# Altium project Nevron_v4.PrjPCB
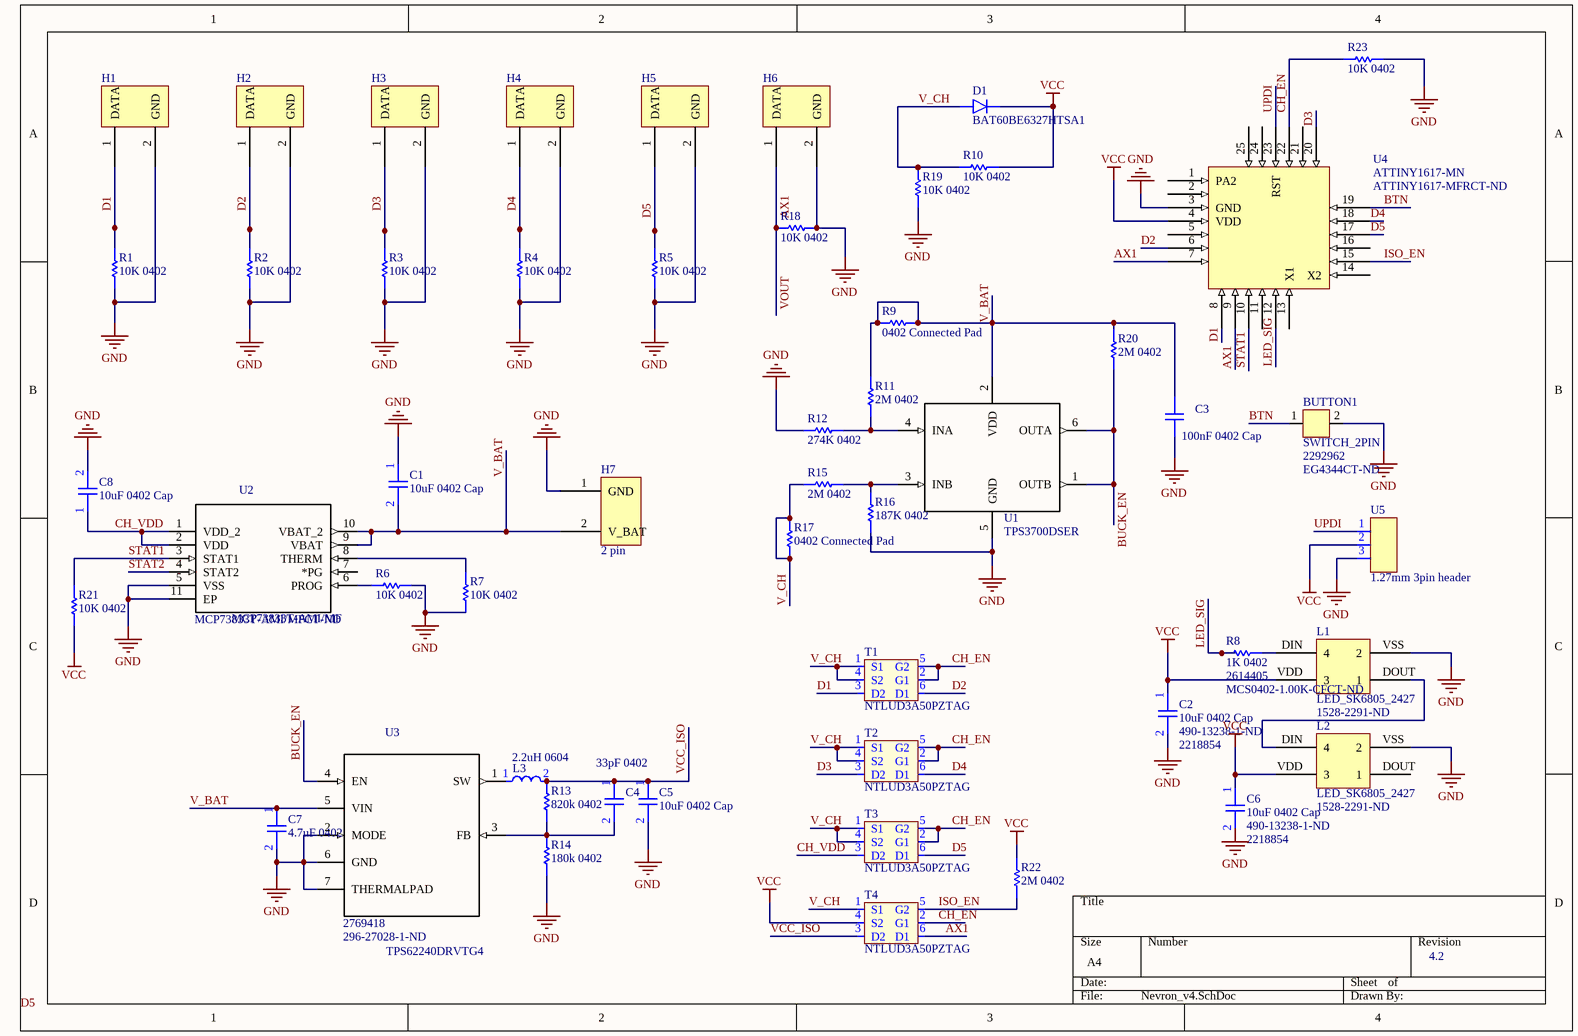
[diagram p0: Nevron_v4.SchDoc]
1 sheet, 52 parts. Net scope: global (net labels, ports and power ports of the same name join across sheets).
Board file: PCB4.PcbDoc

## Sheet Nevron_v4.SchDoc
size A4

### Parts
BUTTON1  SWITCH_2PIN  Supplier Part Number 1: 2292962  Supplier Part Number 2: EG4344CT-ND  [SWITCH- TL1015AF160QG]
C1  10uF 0402 Cap  [0402 Cap]
C2  10uF 0402 Cap  Supplier Part Number 1: 490-13238-1-ND  Supplier Part Number 2: 2218854  [0402 Cap]
C3  100nF 0402 Cap  [0402 Cap]
C4  33pF 0402  [0402 Cap]
C5  10uF 0402 Cap  [0402 Cap]
C6  10uF 0402 Cap  Supplier Part Number 1: 490-13238-1-ND  Supplier Part Number 2: 2218854  [0402 Cap]
C7  4.7uF 0402  [0402 Cap]
C8  10uF 0402 Cap  [0402 Cap]
D1  BAT60BE6327HTSA1  [BAT60BE6327HTSA1]
H1  Magnetci con. 2 pin  [Magnetic con. 2 pin]  (value not drawn)
H2  Magnetci con. 2 pin  [Magnetic con. 2 pin]  (value not drawn)
H3  Magnetci con. 2 pin  [Magnetic con. 2 pin]  (value not drawn)
H4  Magnetci con. 2 pin  [Magnetic con. 2 pin]  (value not drawn)
H5  Magnetci con. 2 pin  [Magnetic con. 2 pin]  (value not drawn)
H6  Magnetci con. 2 pin  [Magnetic con. 2 pin]  (value not drawn)
H7  2 pin  [2_PIN]
L1  LED_SK6805_2427  Supplier Part Number 1: 1528-2291-ND  [LED_SK6805_2427]
L2  LED_SK6805_2427  Supplier Part Number 1: 1528-2291-ND  [LED_SK6805_2427]
L3  2.2uH 0604  [0603 inductor]
R1  10K 0402  [0402 Res]
R2  10K 0402  [0402 Res]
R3  10K 0402  [0402 Res]
R4  10K 0402  [0402 Res]
R5  10K 0402  [0402 Res]
R6  10K 0402  [0402 Res]
R7  10K 0402  [0402 Res]
R8  1K 0402  Supplier Part Number 1: 2614405  Supplier Part Number 2: MCS0402-1.00K-CFCT-ND  [0402 Res]
R9  0402 Connected Pad  [0402 connected pad]
R10  10K 0402  [0402 Res]
R11  2M 0402  [0402 Res]
R12  274K 0402  [0402 Res]
R13  820k 0402  [0402 Res]
R14  180k 0402  [0402 Res]
R15  2M 0402  [0402 Res]
R16  187K 0402  [0402 Res]
R17  0402 Connected Pad  [0402 connected pad]
R18  10K 0402  [0402 Res]
R19  10K 0402  [0402 Res]
R20  2M 0402  [0402 Res]
R21  10K 0402  [0402 Res]
R22  2M 0402  [0402 Res]
R23  10K 0402  [0402 Res]
T1  NTLUD3A50PZTAG  [NTLUD3A50PZTAG]
T2  NTLUD3A50PZTAG  [NTLUD3A50PZTAG]
T3  NTLUD3A50PZTAG  [NTLUD3A50PZTAG]
T4  NTLUD3A50PZTAG  [NTLUD3A50PZTAG]
U1  TPS3700DSER  [TPS3700DSER]
U2  MCP73833T-AMI/MF  Supplier Part Number 1: MCP73833T-AMI/MFCT-ND  [MCP73833T-AMI/MF]
U3  TPS62240DRVTG4  Supplier Part Number 1: 2769418  Supplier Part Number 2: 296-27028-1-ND  [TPS62240DRVR]
U4  ATTINY1617-MN  Supplier Part Number 1: ATTINY1617-MFRCT-ND  [ATtiny1617_QFN50P400X400X90_HS-25M]
U5  1.27mm 3pin header  [1.27mm 3pin header]

### Nets
GND: BUTTON1.2 C1.1 C2.2 C3.2 C5.2 C6.2 C7.2 C8.2 H1.2(GND) H2.2(GND) H3.2(GND) H4.2(GND) H5.2(GND) H6.2(GND) H7.1(GND) L1.VSS(2) L2.VSS(2) R1.2 R2.2 R3.2 R4.2 R5.2 R6.2 R7.2 R12.1 R14.2 R16.2 R18.2 R19.2 R23.2 U1.5(GND) U2.5(VSS) U2.11(EP) U3.2(MODE) U3.6(GND) U3.7(THERMALPAD) U4.3(GND) U5.3
VCC: C2.1 C6.1 D1.K L1.VDD(3) L2.VDD(3) R10.2 R21.2 R22.1 T4.4(S2) U4.4(VDD) U5.2
AX1: H6.1(DATA) R18.1 T4.6(D1) U4.7 U4.9  [also labelled VOUT]
BTN: BUTTON1.1 U4.19
BUCK_EN: R20.2 U1.1(OUTB) U1.6(OUTA) U3.4(EN)
CH_EN: R23.1 T1.2(G1) T1.5(G2) T2.2(G1) T2.5(G2) T3.2(G1) T3.5(G2) T4.2(G1) U4.22
CH_VDD: C8.1 T3.3(D2) U2.1(VDD_2) U2.2(VDD)
D1: H1.1(DATA) R1.1 T1.3(D2) U4.8
D2: H2.1(DATA) R2.1 T1.6(D1) U4.6
D3: H3.1(DATA) R3.1 T2.3(D2) U4.20
D4: H4.1(DATA) R4.1 T2.6(D1) U4.18
D5: H5.1(DATA) R5.1 T3.6(D1) U4.17
ISO_EN: R22.2 T4.5(G2) U4.15
LED_SIG: R8.1 U4.12
STAT1: R21.1 U2.3(STAT1) U4.10
STAT2: U2.4(STAT2)
UPDI: U4.23(RST) U5.1
V_BAT: C1.2 C3.1 C7.1 H7.2(V_BAT) R9.1 R9.2 R11.1 R20.1 U1.2(VDD) U2.9(VBAT) U2.10(VBAT_2) U3.5(VIN)
V_CH: D1.A R10.1 R15.1 R17.1 R17.2 R19.1 T1.1(S1) T1.4(S2) T2.1(S1) T2.4(S2) T3.1(S1) T3.4(S2) T4.1(S1)
VCC_ISO: C4.1 C5.1 L3.2 R13.1 T4.3(D2)
NetC4_2: C4.2 R13.2 R14.1 U3.3(FB)
NetL1_DIN: L1.DIN(4) R8.2
NetL1_DOUT: L1.DOUT(1) L2.DIN(4)
NetL3_1: L3.1 U3.1(SW)
NetR6_1: R6.1 U2.6(PROG)
NetR7_1: R7.1 U2.8(THERM)
NetR11_2: R11.2 R12.2 U1.4(INA)
NetR15_2: R15.2 R16.1 U1.3(INB)

Not connected (* = marked no-connect by the designer): L2 DOUT(1); U2 7(*PG); U4 1(PA2) 2 5 11 13(X1) 14(X2) 16 21 24 25

### Notes on the sheet
- 4.2
- Labels drawn without touching a wire or pin: D5

### Library data of the parts
D1 = BAT60BE6327HTSA1: Diode Schottky 10V 3A Automotive 2-Pin SOD-323 T/R; Manufacturer: Infineon; Element Configuration: Single; Peak Non-Repetitive Surge Current: 5A; Forward Voltage: 600mV; Polarity: Standard; Supplier 1: Farnell; Manufacturer Part Number: BAT60BE6327HTSA1; Stock 1: 14662; Mount: Surface Mount; Case/Package: SOD-323-2; Number of Pins: 2; Min Operating Temperature: -55°C; Max Operating Temperature: 125°C; Forward Current: 3A; Packaging: Tape and Reel; Max Repetitive Reverse Voltage (Vrrm): 10V; Average Rectified Current: 3A; Max Reverse Voltage (DC): 10V; Voltage Rating (DC): 10V; Current Rating: 3A; Output Current: 3A; Radiation Hardening: No; Lead Free: Lead Free; Halogen Free: Not Halogen Free; ComponentLink1URL: http://www.infineon.com/dgdl/bat60bseries.pdf?folderId=db3a304313d846880113def5812204a1&fileId=db3a304314dca3890115195908c50f0b&src-supplier=Avnet; ComponentLink1Description: http://www.infineon.com/dgdl/bat60bseries.pdf?folderId=db3a304313d846880113def5812204a1&fileId=db3a304314dca3890115195908c50f0b&src-supplier=Avnet; ComponentLink2URL: https://www.verical.com/server-webapp/html/getDatasheet?partID=747527&src-supplier=Verical; ComponentLink2Description: https://www.verical.com/server-webapp/html/getDatasheet?partID=747527&src-supplier=Verical; Supplier Part Number 1: 2443539; Supplier 2: Digi-Key; Supplier Part Number 2: BAT60BE6327HTSA1CT-ND
R11 R15 R20 R22 = 2M 0402: RES SMD 2M OHM 1% 1/16W 0402; Manufacturer: Vishay Dale; Manufacturer Part Number: CRCW04021M00DHEDP; Resistance: 1MR; Tolerance: 0.5%; Max Power Dissipation: 63mW; Temperature Coefficient: 50ppm/°C; Case/Package: 0402; Case Code (Metric): 1005; Case Code (Imperial): 0402; Min Operating Temperature: -55°C; Max Operating Temperature: 155°C; Package Quantity: 10000; Packaging: Tape and Reel; Composition: Thick Film; Number of Terminations: 2; Military Standard: Not; Features: Automotive AEC-Q200; Length: 0.039inch; Height: 0.016inch; Width: 0.02inch; Depth: 0.5mm; Lead Free: Lead Free; ComponentLink1URL: http://www.vishay.com/docs/20036/dcrcwpe3.pdf?src-supplier=Digi-Key; ComponentLink1Description: http://www.vishay.com/docs/20036/dcrcwpe3.pdf?src-supplier=Digi-Key; Supplier 1: Digi-Key; Supplier Part Number 1: 541-4066-6-ND
U1 = TPS3700DSER: IC COMPARATOR WINDOW; Manufacturer: Texas Instruments; Max Supply Voltage: 18V; Min Supply Voltage: 1.8V; Propagation Delay: 29us; Number of Elements: 1; Quiescent Current: 13uA; Hysteresis: 5.5mV; Input Bias Current: 25nA; Supplier 1: Digi-Key; Manufacturer Part Number: TPS3700DSER; Stock 1: 11662; Pricing 1: 1=1.84, 10=1.657, 100=1.3317, 500=1.09412, 1000=0.90655 (USD); Mount: Surface Mount; Case/Package: WFDFN; Number of Pins: 6; Min Operating Temperature: -40°C; Max Operating Temperature: 125°C; Packaging: Tape and Reel; Package Quantity: 3000; Number of Channels: 1; Max Supply Current: 13uA; Turn-On Delay Time: 29us; Radiation Hardening: No; Lead Free: Lead Free; ComponentLink1URL: http://www.ti.com/lit/gpn/tps3700?src-supplier=Mouser; ComponentLink1Description: http://www.ti.com/lit/gpn/tps3700?src-supplier=Mouser; ComponentLink2URL: http://www.ti.com/lit/ds/symlink/tps3700.pdf?src-supplier=Digi-Key; ComponentLink2Description: http://www.ti.com/lit/ds/symlink/tps3700.pdf?src-supplier=Digi-Key; ComponentLink3URL: http://www.ti.com/lit/ds/symlink/tps3700.pdf?src-supplier=Avnet; ComponentLink3Description: http://www.ti.com/lit/ds/symlink/tps3700.pdf?src-supplier=Avnet; Supplier Part Number 1: 296-40742-1-ND; Supplier 2: Farnell; Supplier Part Number 2: 3005631
U2 = MCP73833T-AMI/MF: Linear Charge Management Controller Li-Ion/Li-Pol 1mA 4.2V/4.35V/4.4V/4.5V 10-Pin DFN EP T/R; MP: MCP73833-AMI/UN; MF: Microchip; Availability: Unavailable; Package: MSOP-10 Microchip; Price: None; SnapEDA_Link: https://www.snapeda.com/parts/MCP73833-AMI/UN/Microchip/view-part/?ref=snap; Value: *; Supplier 1: Digi-Key
U3 = TPS62240DRVR: Conv DC-DC 2V to 6V Synchronous Step Down Single-Out 0.6V to 6V 0.3A 6-Pin WSON EP T/R; MF: Texas Instruments; SnapEDA_Link: https://www.snapeda.com/parts/TPS62240DRVTG4/Texas%20Instruments/view-part/?ref=snap; Availability: Unavailable; Price: None; MP: TPS62240DRVTG4; Package: SON-6 Texas Instruments; Value: *; Supplier 1: Farnell; Supplier 2: Digi-Key
BUTTON1 = SWITCH_2PIN: Supplier 1: Farnell; Supplier 2: Digi-Key
C1 C2 C5 C6 C8 = 10uF 0402 Cap: Supplier 1: Digi-Key; Supplier 2: Farnell
  C1 C5 C8: Supplier Part Number 1: 490-13238-1-ND; Supplier Part Number 2: 2218854
C3 = 100nF 0402 Cap: Supplier 1: Digi-Key; Supplier Part Number 1: 490-6287-1-ND
C4 = 33pF 0402: Supplier 1: Farnell; Supplier 2: Digi-Key; Supplier Part Number 1: 2940852; Supplier Part Number 2: 399-13709-1-ND
C7 = 4.7uF 0402: Supplier 1: Digi-Key; Supplier 2: Farnell; Supplier Part Number 1: 490-14306-1-ND; Supplier Part Number 2: 2688503
L1 L2 = LED_SK6805_2427: Supplier 1: Digi-Key
L3 = 2.2uH 0604: Supplier 1: Farnell; Supplier 2: Digi-Key; Supplier Part Number 1: 2215629; Supplier Part Number 2: 445-6385-1-ND
R1-R7 R10 R18 R19 R21 R23 = 10K 0402: Supplier 1: Digi-Key; Supplier 2: Farnell; Supplier Part Number 1: MCS0402-10.0K-CFCT-ND; Supplier Part Number 2: 2614406
R8 = 1K 0402: Supplier 1: Farnell; Supplier 2: Digi-Key
R12 = 274K 0402: Supplier 1: Digi-Key; Supplier Part Number 1: P27.4KLDKR-ND
R13 = 820k 0402: Supplier 1: Farnell; Supplier 2: Digi-Key; Supplier Part Number 1: 9239570; Supplier Part Number 2: YAG3240CT-ND
R14 = 180k 0402: Supplier 1: Farnell; Supplier 2: Digi-Key; Supplier Part Number 1: 2330492; Supplier Part Number 2: A103794CT-ND
R16 = 187K 0402: Supplier 1: Digi-Key; Supplier Part Number 1: P187KLDKR-ND
T1-T4 = NTLUD3A50PZTAG: Supplier 1: Digi-Key; Supplier 2: Farnell; Supplier Part Number 1: NTLUD3A50PZTAGOSCT-ND; Supplier Part Number 2: 2724458
U4 = ATTINY1617-MN: Supplier 1: Digi-Key